# Altium schematic sheet 电机驱动—加密版.SchDoc
size A3
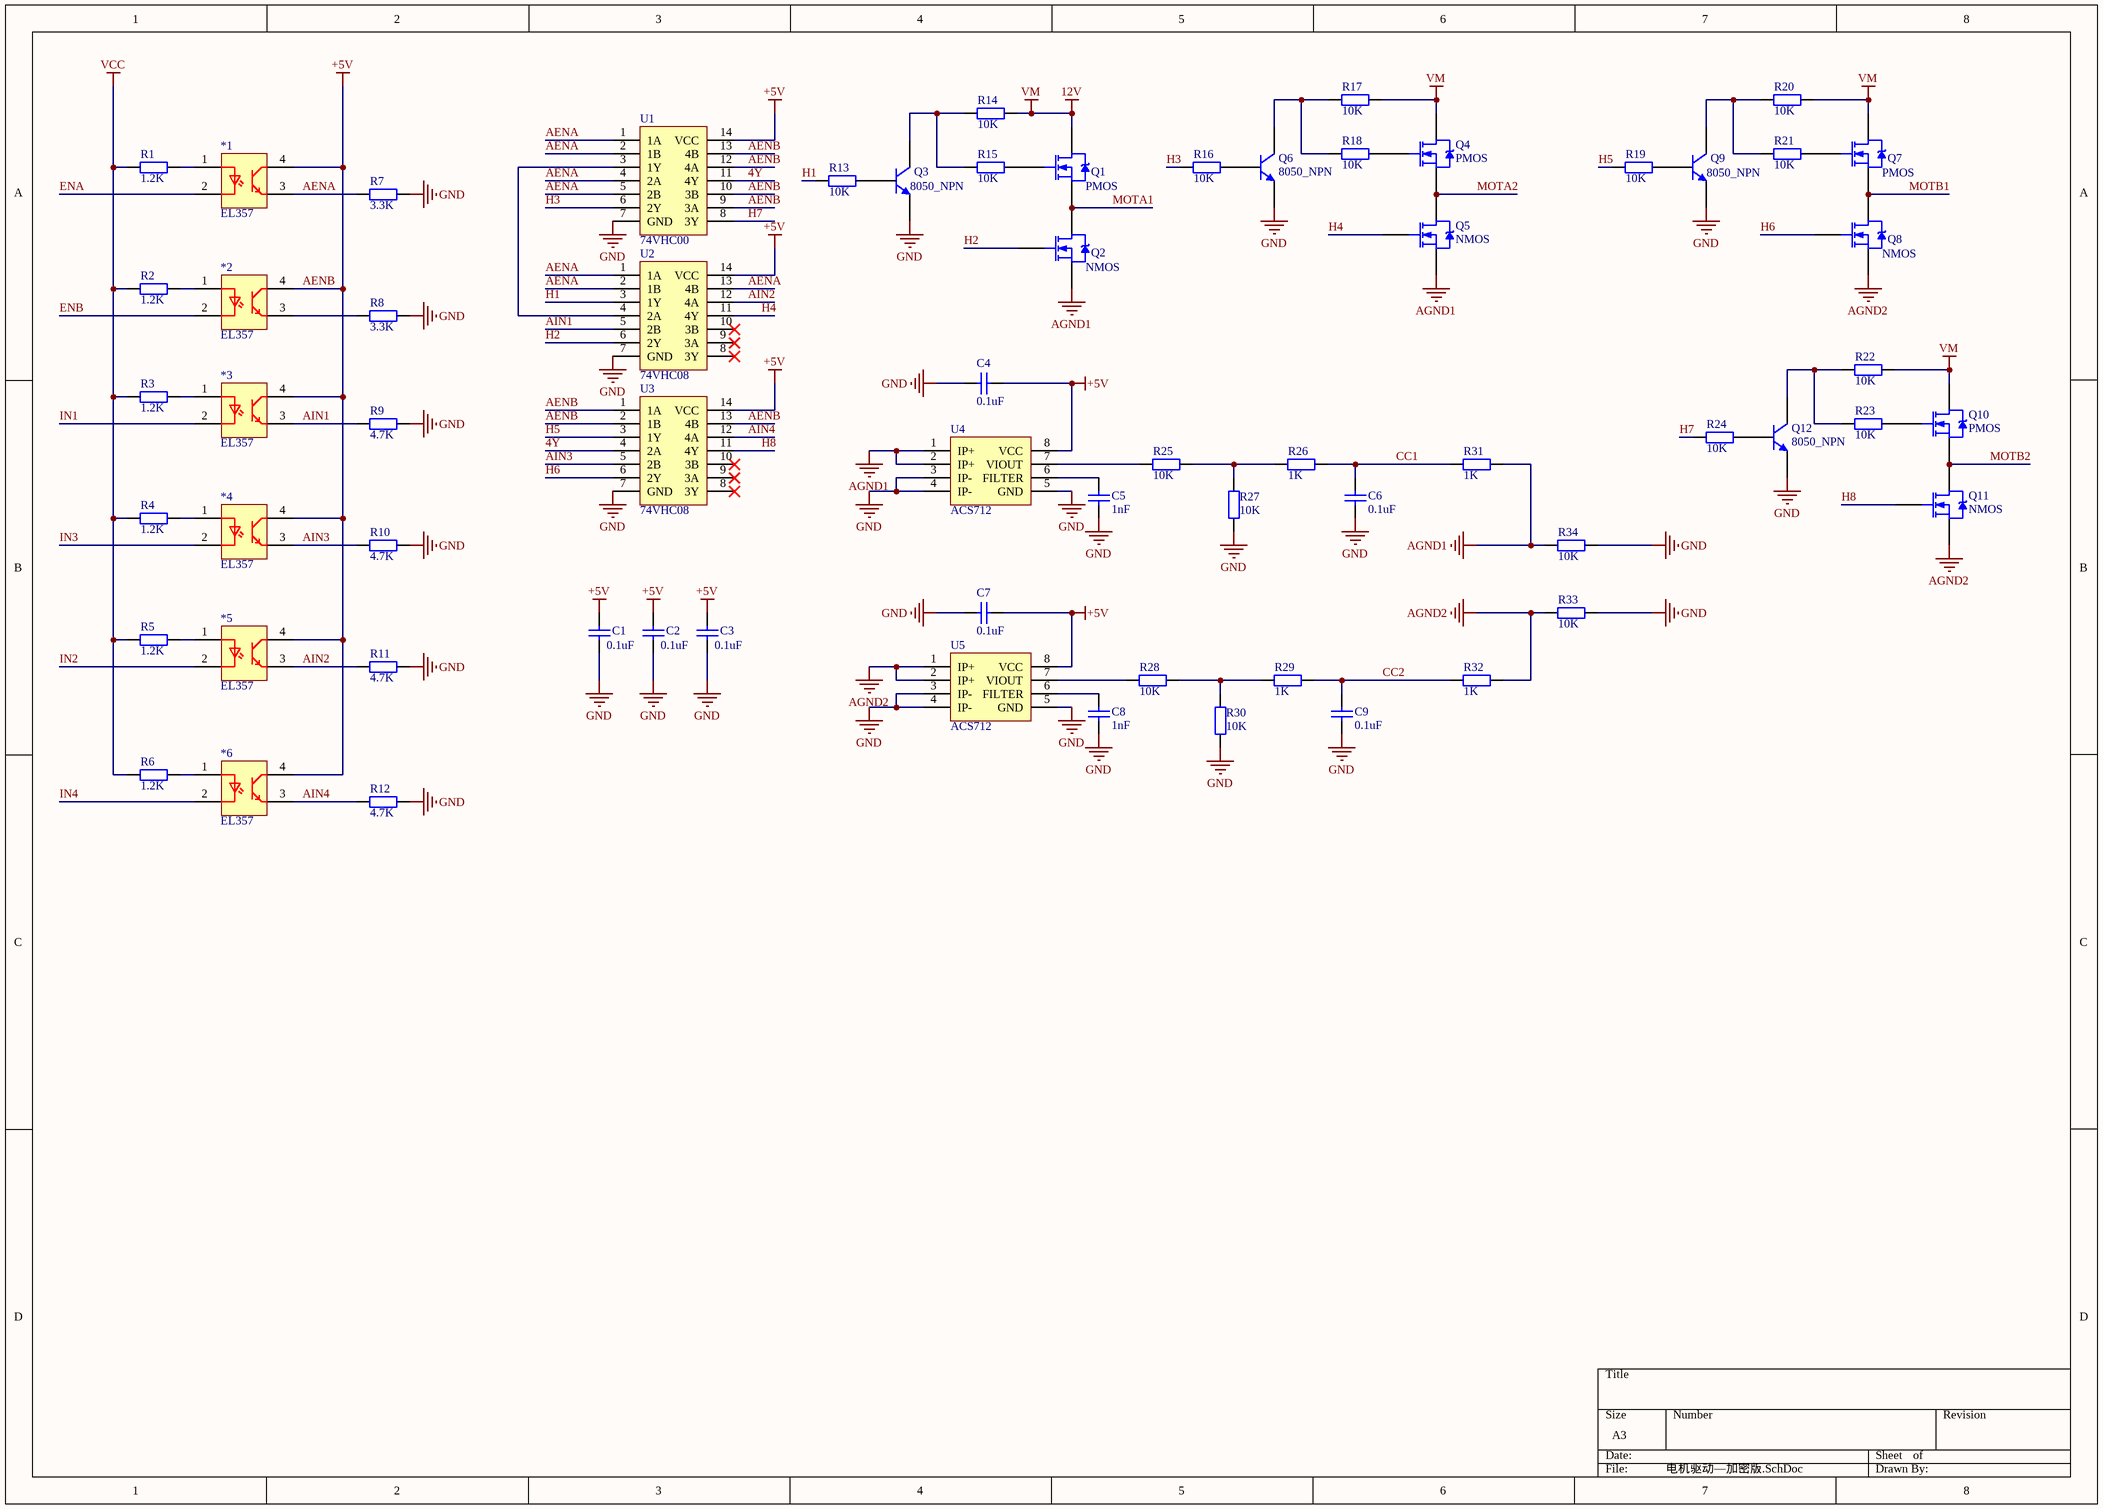
[diagram p0: 电机驱动—加密版.SchDoc]

## Parts
*1  EL357  [EL357]
*2  EL357  [EL357]
*3  EL357  [EL357]
*4  EL357  [EL357]
*5  EL357  [EL357]
*6  EL357  [EL357]
C1  value 0.1uF  [1608[0603]]  (hidden comment: 104)
C2  value 0.1uF  [1608[0603]]  (hidden comment: 104)
C3  value 0.1uF  [1608[0603]]  (hidden comment: 104)
C4  value 0.1uF  [1608[0603]]  (hidden comment: 104)
C5  value 1nF  [1608[0603]]  (hidden comment: 102)
C6  value 0.1uF  [1608[0603]]  (hidden comment: 104)
C7  value 0.1uF  [1608[0603]]  (hidden comment: 104)
C8  value 1nF  [1608[0603]]  (hidden comment: 102)
C9  value 0.1uF  [1608[0603]]  (hidden comment: 104)
Q1  PMOS  [TO-252AA_M]
Q2  NMOS  [TO-252AA_M]
Q3  8050_NPN  [SOT-23]
Q4  PMOS  [TO-252AA_M]
Q5  NMOS  [TO-252AA_M]
Q6  8050_NPN  [SOT-23]
Q7  PMOS  [TO-252AA_M]
Q8  NMOS  [TO-252AA_M]
Q9  8050_NPN  [SOT-23]
Q10  PMOS  [TO-252AA_M]
Q11  NMOS  [TO-252AA_M]
Q12  8050_NPN  [SOT-23]
R1  1.2K  [0603-r]
R2  1.2K  [0603-r]
R3  1.2K  [0603-r]
R4  1.2K  [0603-r]
R5  1.2K  [0603-r]
R6  1.2K  [0603-r]
R7  3.3K  [0603-r]
R8  3.3K  [0603-r]
R9  4.7K  [0603-r]
R10  4.7K  [0603-r]
R11  4.7K  [0603-r]
R12  4.7K  [0603-r]
R13  10K  [0603-r]
R14  10K  [0603-r]
R15  10K  [0603-r]
R16  10K  [0603-r]
R17  10K  [0603-r]
R18  10K  [0603-r]
R19  10K  [0603-r]
R20  10K  [0603-r]
R21  10K  [0603-r]
R22  10K  [0603-r]
R23  10K  [0603-r]
R24  10K  [0603-r]
R25  10K  [0603-r]
R26  1K  [0603-r]
R27  10K  [0603-r]
R28  10K  [0603-r]
R29  1K  [0603-r]
R30  10K  [0603-r]
R31  1K  [0603-r]
R32  1K  [0603-r]
R33  10K  [0603-r]
R34  10K  [0603-r]
U1  74VHC00  [SO-14]
U2  74VHC08  [SO-14]
U3  74VHC08  [SO-14]
U4  ACS712  [SO-8]
U5  ACS712  [SO-8]

## Nets
12V: Q1.4(D) Q4.4(D) Q7.4(D) Q10.4(D) R14.2 R17.2 R20.2 R22.2  [also labelled VM]
AENB: *1.4 *2.4 *3.4 *4.4 *5.4 *6.4 C1.2 C2.2 C3.2 C4.2 C7.2 U1.9(3A) U1.10(3B) U1.12(4A) U1.13(4B) U1.14(VCC) U2.14(VCC) U3.1(1A) U3.2(1B) U3.13(4B) U3.14(VCC) U4.8(VCC) U5.8(VCC)  [also labelled +5V]
AGND1: Q2.3(S) Q5.3(S) R31.2 R34.2 U4.1(IP+) U4.2(IP+)
AGND2: Q8.3(S) Q11.3(S) R32.2 R33.2 U5.1(IP+) U5.2(IP+)
GND: C1.1 C2.1 C3.1 C4.1 C5.1 C6.1 C7.1 C8.1 C9.1 Q3.1(E) Q6.1(E) Q9.1(E) Q12.1(E) R7.2 R8.2 R9.2 R10.2 R11.2 R12.2 R27.1 R30.1 R33.1 R34.1 U1.7(GND) U2.7(GND) U3.7(GND) U4.3(IP-) U4.4(IP-) U4.5(GND) U5.3(IP-) U5.4(IP-) U5.5(GND)
VCC: R1.1 R2.1 R3.1 R4.1 R5.1 R6.1
4Y: U1.11(4Y) U3.4(2A)
AENA: *1.3 R7.1 U1.1(1A) U1.2(1B) U1.4(2A) U1.5(2B) U2.1(1A) U2.2(1B) U2.13(4B)
AIN1: *3.3 R9.1 U2.5(2B)
AIN2: *5.3 R11.1 U2.12(4A)
AIN3: *4.3 R10.1 U3.5(2B)
AIN4: *6.3 R12.1 U3.12(4A)
CC1: C6.2 R26.2 R31.1
CC2: C9.2 R29.2 R32.1
ENA: *1.2
ENB: *2.2
H1: R13.1 U2.3(1Y)
H2: Q2.1(G) U2.6(2Y)
H3: R16.1 U1.6(2Y)
H4: Q5.1(G) U2.11(4Y)
H5: R19.1 U3.3(1Y)
H6: Q8.1(G) U3.6(2Y)
H7: R24.1 U1.8(3Y)
H8: Q11.1(G) U3.11(4Y)
IN1: *3.2
IN2: *5.2
IN3: *4.2
IN4: *6.2
MOTA1: Q1.3(S) Q2.4(D)
MOTA2: Q4.3(S) Q5.4(D)
MOTB1: Q7.3(S) Q8.4(D)
MOTB2: Q10.3(S) Q11.4(D)
Net*1_1: *1.1 R1.2
Net*2_1: *2.1 R2.2
Net*2_3: *2.3 R8.1
Net*3_1: *3.1 R3.2
Net*4_1: *4.1 R4.2
Net*5_1: *5.1 R5.2
Net*6_1: *6.1 R6.2
NetC5_2: C5.2 U4.6(FILTER)
NetC8_2: C8.2 U5.6(FILTER)
NetQ1_1: Q1.1(G) R15.2
NetQ3_2: Q3.2(B) R13.2
NetQ3_3: Q3.3(C) R14.1 R15.1
NetQ4_1: Q4.1(G) R18.2
NetQ6_2: Q6.2(B) R16.2
NetQ6_3: Q6.3(C) R17.1 R18.1
NetQ7_1: Q7.1(G) R21.2
NetQ9_2: Q9.2(B) R19.2
NetQ9_3: Q9.3(C) R20.1 R21.1
NetQ10_1: Q10.1(G) R23.2
NetQ12_2: Q12.2(B) R24.2
NetQ12_3: Q12.3(C) R22.1 R23.1
NetR25_1: R25.1 U4.7(VIOUT)
NetR25_2: R25.2 R26.1 R27.2
NetR28_1: R28.1 U5.7(VIOUT)
NetR28_2: R28.2 R29.1 R30.2
NetU1_3: U1.3(1Y) U2.4(2A)

Not connected (* = marked no-connect by the designer): U2 8(3Y)* 9(3A)* 10(3B)*; U3 8(3Y)* 9(3A)* 10(3B)*

## Library data of the parts
*1-*6 U1-U5 = Component_1
C1-C9 = Cap Semi: Capacitor (Semiconductor SIM Model); Published: 8-Jun-2000; LatestRevisionDate: 17-Jul-2002; LatestRevisionNote: Re-released for DXP Platform.; PackageReference: C1206; Publisher: Altium Limited
Q1 Q2 Q4 Q5 Q7 Q8 Q10 Q11 = IRLR7843
Q3 Q6 Q9 Q12 = 2N3904: NPN General Purpose Amplifier; Published: 8-Jun-2000; LatestRevisionDate: 15-Jan-2003; LatestRevisionNote: PCB Footprint 'BCY-W3/D4.7' replaced; DatasheetDocument: 1997; PackageDocument: Sep-1998; PackageReference: TO-92A; Publisher: Altium Limited; Code_JEDEC: TO-92A; ComponentLink1Description: Manufacturer Link; ComponentLink1URL: http://www.fairchildsemi.com/; ComponentLink2Description: Datasheet; ComponentLink2URL: http://www.fairchildsemi.com/ds/2N%2F2N3904.pdf
R1-R34 = RES